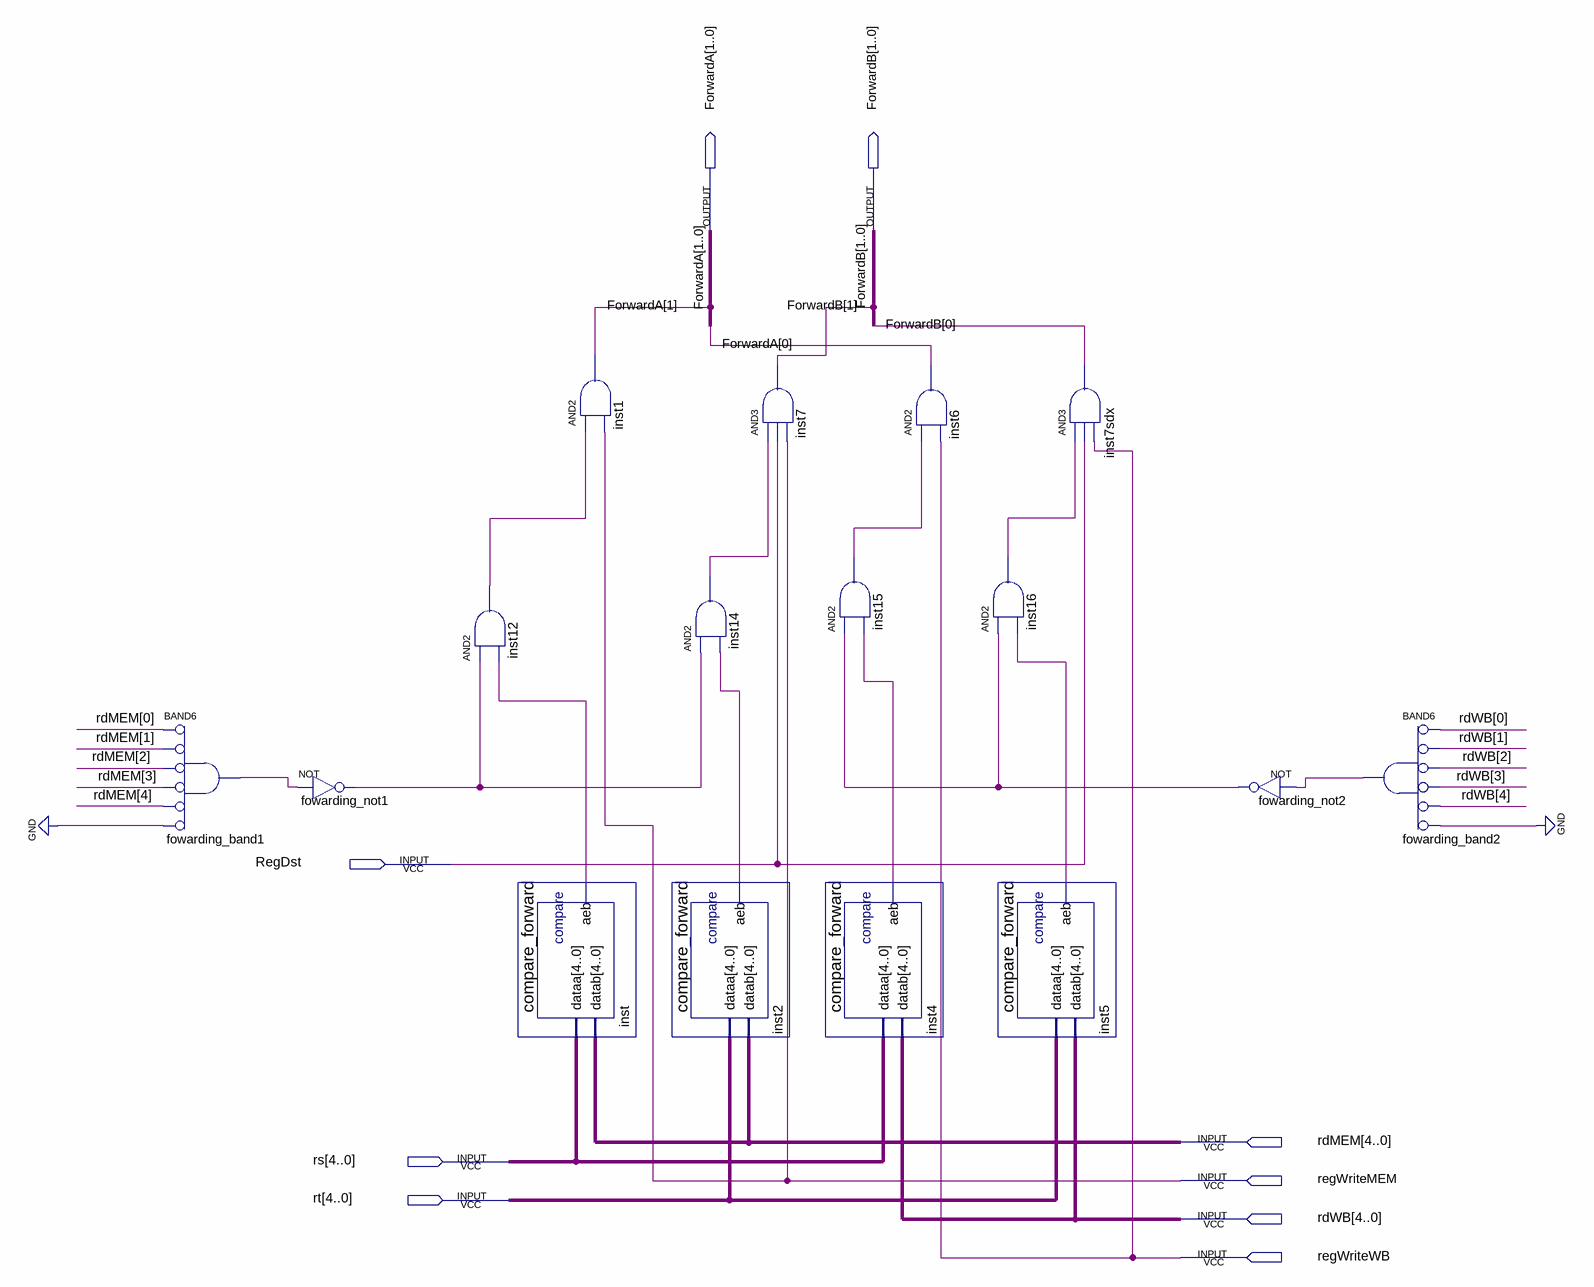
[diagram p0: schematic sheet]
// Quartus schematic forwarding.bdf as structural Verilog: 16 symbols, 9 pins
module forwarding (
  input  RegDst,
  input  [4:0] rdMEM,
  input  [4:0] rs,
  input  regWriteMEM,
  input  [4:0] rt,
  input  [4:0] rdWB,
  input  regWriteWB,
  output [1:0] ForwardA,
  output [1:0] ForwardB
);

  wire fowarding_band1_out, fowarding_band2_out, fowarding_not1_out, fowarding_not2_out, inst2_aeb,
       inst4_aeb, inst5_aeb, inst12_out, inst14_out, inst15_out, inst16_out, inst_aeb;

  and fowarding_band1 (fowarding_band1_out, ~rdMEM[0], ~rdMEM[1], ~rdMEM[2], ~rdMEM[3], ~rdMEM[4], ~1'b0);  // BAND6
  not fowarding_not1 (fowarding_not1_out, fowarding_band1_out);
  and inst12 (inst12_out, fowarding_not1_out, inst_aeb);
  compare_forward inst (.dataa(rs), .datab(rdMEM), .aeb(inst_aeb));
  and inst1 (ForwardA[1], inst12_out, regWriteMEM);
  and inst14 (inst14_out, fowarding_not1_out, inst2_aeb);
  compare_forward inst2 (.dataa(rt), .datab(rdMEM), .aeb(inst2_aeb));
  and inst7 (ForwardB[1], inst14_out, RegDst, regWriteMEM);
  and inst15 (inst15_out, fowarding_not2_out, inst4_aeb);
  compare_forward inst4 (.dataa(rs), .datab(rdWB), .aeb(inst4_aeb));
  and inst6 (ForwardA[0], inst15_out, regWriteWB);
  and inst16 (inst16_out, fowarding_not2_out, inst5_aeb);
  and inst7sdx (ForwardB[0], inst16_out, RegDst, regWriteWB);
  compare_forward inst5 (.dataa(rt), .datab(rdWB), .aeb(inst5_aeb));
  not fowarding_not2 (fowarding_not2_out, fowarding_band2_out);
  and fowarding_band2 (fowarding_band2_out, ~rdWB[0], ~rdWB[1], ~rdWB[2], ~rdWB[3], ~rdWB[4], ~1'b0);  // BAND6
endmodule
